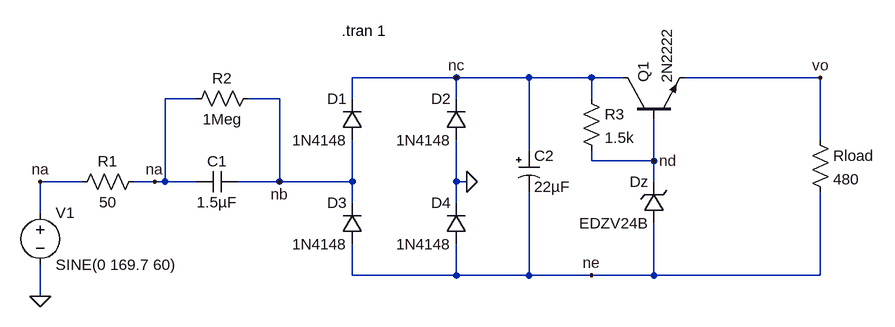
[diagram p0: schematic FuenteCapacitivaReal.asc]
FuenteCapacitivaReal.asc, the LTspice schematic file:
Version 4
SHEET 1 1128 680
WIRE 48 -160 -112 -160
WIRE 160 -160 48 -160
WIRE 256 -160 160 -160
WIRE 304 -160 256 -160
WIRE 608 -160 400 -160
WIRE -352 -128 -400 -128
WIRE -224 -128 -272 -128
WIRE -112 -128 -112 -160
WIRE 48 -128 48 -160
WIRE 256 -128 256 -160
WIRE 608 -64 608 -160
WIRE 160 -48 160 -160
WIRE 256 -32 256 -48
WIRE 352 -32 352 -96
WIRE 352 -32 256 -32
WIRE -528 0 -592 0
WIRE -416 0 -448 0
WIRE -400 0 -400 -128
WIRE -400 0 -416 0
WIRE -352 0 -400 0
WIRE -224 0 -224 -128
WIRE -224 0 -288 0
WIRE -112 0 -112 -64
WIRE -112 0 -224 0
WIRE 48 0 48 -64
WIRE 64 0 48 0
WIRE 352 0 352 -32
WIRE -112 32 -112 0
WIRE 48 32 48 0
WIRE -592 48 -592 0
WIRE -112 144 -112 96
WIRE 48 144 48 96
WIRE 48 144 -112 144
WIRE 160 144 160 16
WIRE 160 144 48 144
WIRE 256 144 160 144
WIRE 352 144 352 64
WIRE 352 144 256 144
WIRE 608 144 608 16
WIRE 608 144 352 144
WIRE -592 176 -592 128
FLAG -592 176 0
FLAG 64 0 0
FLAG 608 -160 vo
FLAG -592 0 na
FLAG -416 0 na
FLAG -224 0 nb
FLAG 48 -160 nc
FLAG 352 -32 nd
FLAG 256 144 ne
SYMBOL diode -96 -64 R180
WINDOW 0 24 64 Left 2
WINDOW 3 24 0 Left 2
SYMATTR InstName D1
SYMATTR Value 1N4148
SYMBOL diode 64 -64 R180
WINDOW 0 24 64 Left 2
WINDOW 3 24 0 Left 2
SYMATTR InstName D2
SYMATTR Value 1N4148
SYMBOL diode -96 96 R180
WINDOW 0 24 64 Left 2
WINDOW 3 24 0 Left 2
SYMATTR InstName D3
SYMATTR Value 1N4148
SYMBOL diode 64 96 R180
WINDOW 0 24 64 Left 2
WINDOW 3 24 0 Left 2
SYMATTR InstName D4
SYMATTR Value 1N4148
SYMBOL voltage -592 32 R0
WINDOW 123 0 0 Left 2
WINDOW 39 0 0 Left 2
SYMATTR InstName V1
SYMATTR Value SINE(0 169.7 60)
SYMBOL res -432 -16 R90
WINDOW 0 0 56 VBottom 2
WINDOW 3 32 56 VTop 2
SYMATTR InstName R1
SYMATTR Value 50
SYMATTR SpiceLine tol=5 pwr=0.25
SYMBOL res -256 -144 R90
WINDOW 0 0 56 VBottom 2
WINDOW 3 32 56 VTop 2
SYMATTR InstName R2
SYMATTR Value 1Meg
SYMATTR SpiceLine tol=5 pwr=0.25
SYMBOL cap -288 -16 R90
WINDOW 0 0 32 VBottom 2
WINDOW 3 32 32 VTop 2
SYMATTR InstName C1
SYMATTR Value 1.5µF
SYMBOL polcap 144 -48 R0
SYMATTR InstName C2
SYMATTR Value 22µF
SYMBOL res 592 -80 R0
SYMATTR InstName Rload
SYMATTR Value 480
SYMBOL zener 368 64 R180
WINDOW 0 24 64 Left 2
WINDOW 3 24 0 Left 2
SYMATTR InstName Dz
SYMATTR Value EDZV24B
SYMBOL npn 304 -96 R270
SYMATTR InstName Q1
SYMATTR Value 2N2222
SYMBOL res 240 -144 R0
SYMATTR InstName R3
SYMATTR Value 1.5k
SYMATTR SpiceLine tol=5 pwr=0.25
TEXT -128 -232 Left 2 !.tran 1

The netlist it stands for:
* FuenteCapacitivaReal.asc
D1 nb nc 1N4148
D2 0 nc 1N4148
D3 ne nb 1N4148
D4 ne 0 1N4148
V1 na 0 SINE(0 169.7 60)
R1 na na 50 tol=5 pwr=0.25
R2 nb na 1Meg tol=5 pwr=0.25
C1 nb na 1.5µF
C2 nc ne 22µF
Rload vo ne 480
Dz ne nd EDZV24B
Q1 nc nd vo 0 2N2222
R3 nc nd 1.5k tol=5 pwr=0.25
.model D D
.lib standard.dio
.model NPN NPN
.model PNP PNP
.lib standard.bjt
.tran 1
.backanno
.end